# Altium schematic sheet HV9150 DevKit.SchDoc: HV9150 DevKit
size A4; Organization: Altium Limited; Address1: L3, 12a Rodborough Rd; Address2: Frenchs Forest; Address3: NSW; Address4: Australia 2086; DocumentNumber: 1; Revision: 1.0; SheetNumber: 1; SheetTotal: 1
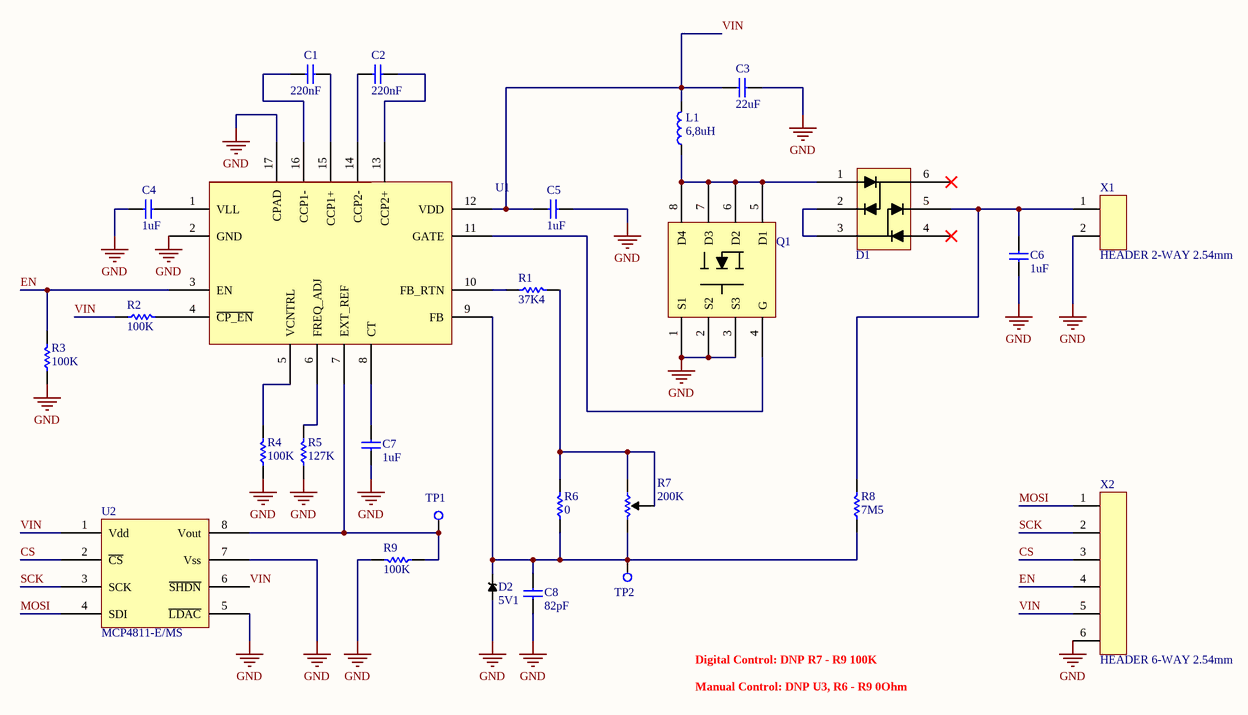
[diagram p0: HV9150 DevKit.SchDoc]

## Parts
C1  220nF  [CAP 0805/2012]
C2  220nF  [CAP 0805/2012]
C3  22uF  [CAP 1206/3216]
C4  1uF  [CAP 0805/2012]
C5  1uF  [CAP 0805/2012]
C6  1uF  [CAP 2220/5650]
C7  1uF  [CAP 0805/2012]
C8  82pF  [CAP 0805/2012]
D1  BAV99S,115  [SOT-363]  (value not drawn)
D2  5V1  [DZ2705100L -  Diodo Zener]
L1  6,8uH  [WE-LHMI_4020]
Q1  BSZ42DN25NS3G  [BSZ42DN25NS3]  (value not drawn)
R1  37K4  [RES 0805/2012]
R2  100K  [RES 0805/2012]
R3  100K  [RES 0805/2012]
R4  100K  [RES 0805/2012]
R5  127K  [RES 0805/2012]
R6  0  [RES 0805/2012]
R7  200K  [BOURNS 3386F]
R8  7M5  [RES 1206/3216]
R9  100K  [RES 0805/2012]
TP1  TESTPOINT  [TP_SMD_Ø1.0mm]  (value not drawn)
TP2  TESTPOINT  [TP_SMD_Ø1.0mm]  (value not drawn)
U1  HV9150K6-G  [QFN16 3X3]  (value not drawn)
U2  MCP4811-E/MS  [MSOP8]
X1  HEADER 2-WAY 2.54mm  [HEADER 2-WAY 2.54 mm]
X2  HEADER 6-WAY 2.54mm  [HEADER 6-WAY 2.54 mm]

## Nets
GND: C3.2 C4.1 C5.1 C6.1 C7.1 C8.1 D2.1(A) Q1.1(S1) Q1.2(S2) Q1.3(S3) R3.1 R4.1 R5.1 R9.2 U1.2(GND) U1.17(CPAD) U2.5(~{LDAC}) U2.7(Vss) X1.2 X2.6
CS: U2.2(~{CS}) X2.3
EN: R3.2 U1.3(EN) X2.4
MOSI: U2.4(SDI) X2.1
SCK: U2.3(SCK) X2.2
VIN: C3.1 C5.2 L1.2 R2.1 U1.12(VDD) U2.1(Vdd) U2.6(~{SHDN}) X2.5
NetC1_1: C1.1 U1.16(CCP1-)
NetC1_2: C1.2 U1.15(CCP1+)
NetC2_1: C2.1 U1.14(CCP2-)
NetC2_2: C2.2 U1.13(CCP2+)
NetC4_2: C4.2 U1.1(VLL)
NetC6_2: C6.2 D1.5 R8.2 X1.1
NetC7_2: C7.2 U1.8(CT)
NetC8_2: C8.2 D2.2(K) R6.1 R7.3 R8.1 TP2.1(TP) U1.9(FB)
NetD1_1: D1.1 L1.1 Q1.5(D1) Q1.6(D2) Q1.7(D3) Q1.8(D4)
NetD1_2: D1.2 D1.3
NetQ1_4: Q1.4(G) U1.11(GATE)
NetR1_1: R1.1 U1.10(FB_RTN)
NetR1_2: R1.2 R6.2 R7.1 R7.2
NetR2_2: R2.2 U1.4(~{CP_EN})
NetR4_2: R4.2 U1.5(VCNTRL)
NetR5_2: R5.2 U1.6(FREQ_ADJ)
NetR9_1: R9.1 TP1.1(TP) U1.7(EXT_REF) U2.8(Vout)

Not connected (* = marked no-connect by the designer): D1 4* 6*

## Notes on the sheet
- Digital Control: DNP R7 - R9 100K
- Manual Control: DNP U3, R6 - R9 0Ohm
- Title:
- Size:
- Date:
- A4
- Number:
- Revision:
- Sheet
- of
- File:

## Library data of the parts
C1 C2 = 0805YC224MAT2A: CAPACITOR 220nF 0805 20%16V; Manufacturer: Kyocera AVX; Tolerance: 20%; Voltage Rating: 16V; Dielectric: X7R; Dissipation Factor: 3.5%; Supplier 1: Farnell; Manufacturer Part Number: 0805YC224MAT2A; Stock 1: 0; Pricing 1: 4000=0.0977, 8000=0.0958, 16000=0.0934 (EUR); Mount: Surface Mount; Case/Package: 0805; Number of Pins: 2; Case Code (Imperial): 0805; Case Code (Metric): 2012; Min Operating Temperature: -55°C; Max Operating Temperature: 125°C; Capacitance: 220nF; Packaging: Tape and Reel; Package Quantity: 4000; Voltage Rating (DC): 16V; Termination: SMD/SMT; Length: 2.01mm; Height: 0.94mm; Width: 1.25mm; Thickness: 0.037inch; Depth: 1.25mm; REACH SVHC: Unknown; Lead Free: Lead Free; ComponentLink1URL: http://www.mouser.com/ds/2/40/X7RDielectric-777024.pdf?src-supplier=Mouser; ComponentLink1Description: http://www.mouser.com/ds/2/40/X7RDielectric-777024.pdf?src-supplier=Mouser; ComponentLink2URL: http://www.avx.com/docs/Catalogs/cx7r.pdf?src-supplier=Avnet; ComponentLink2Description: http://www.avx.com/docs/Catalogs/cx7r.pdf?src-supplier=Avnet; ComponentLink3URL: http://datasheets.avx.com/X7RDielectric.pdf?src-supplier=Digi-Key; ComponentLink3Description: http://datasheets.avx.com/X7RDielectric.pdf?src-supplier=Digi-Key; Value: 220nF
C3 = F931C226MAA: CAPACITOR 22uF 1206 20% 16V; Manufacturer: Kyocera AVX; Supplier 1: Farnell; Manufacturer Part Number: F931C226MAA; Stock 1: 0; Pricing 1: 150=0.395, 250=0.29, 500=0.249, 1000=0.22, 2000=0.188, 10000=0.173 (EUR); Value: 22uF
C4 C5 C7 = CC0805KKX7R7BB105: CAPACITOR 1uF 0805 10% 16V; Manufacturer: Yageo; Dielectric: X7R; Supplier 1: Farnell; Manufacturer Part Number: CC0805KKX7R7BB105; Stock 1: 0; Mount: Surface Mount; Case/Package: 0805; Case Code (Metric): 2012; Case Code (Imperial): 0805; Min Operating Temperature: -55°C; Max Operating Temperature: 125°C; Capacitance: 1uF; Tolerance: 10%; Packaging: Tape and Reel; Voltage Rating: 16V; Package Quantity: 1; Termination: SMD/SMT; Voltage Rating (DC): 16V; Length: 2mm; Depth: 1.25mm; Width: 0.049inch; Thickness: 0.049inch; Radiation Hardening: No; REACH SVHC: No SVHC; Lead Free: Lead Free; Halogen Free: Halogen Free; ComponentLink1URL: http://www.yageo.com/documents/recent/UPY-GPHC_X7R_6.3V-to-50V_18.pdf?src-supplier=Digi-Key; ComponentLink1Description: http://www.yageo.com/documents/recent/UPY-GPHC_X7R_6.3V-to-50V_18.pdf?src-supplier=Digi-Key; ComponentLink2URL: http://www.mouser.com/ds/2/447/Yageo_UPY-GP_NP0_16V-to-50V_9-358835.pdf?src-supplier=Mouser; ComponentLink2Description: http://www.mouser.com/ds/2/447/Yageo_UPY-GP_NP0_16V-to-50V_9-358835.pdf?src-supplier=Mouser; ComponentLink3URL: https://www.verical.com/server-webapp/html/getDatasheet?partID=251802&src-supplier=Verical; ComponentLink3Description: https://www.verical.com/server-webapp/html/getDatasheet?partID=251802&src-supplier=Verical; ComponentLink4URL: http://www.farnell.com/datasheets/1489800.pdf?src-supplier=Element14; ComponentLink4Description: http://www.farnell.com/datasheets/1489800.pdf?src-supplier=Element14; ComponentLink5URL: http://www.yageo.com/documents/recent/UPY-GPHC_X7R_6.3V-to-50V_8.pdf?src-supplier=Avnet; ComponentLink5Description: http://www.yageo.com/documents/recent/UPY-GPHC_X7R_6.3V-to-50V_8.pdf?src-supplier=Avnet; Value: 1uF
C6 = C2220C105MCR2C7186: CAPACITOR 1uF 2220 20% 500V; Manufacturer: KEMET; Dielectric Material: Ceramic; Dielectric: X7R; Voltage Rating (DC): 1kV; Supplier 1: Farnell; Manufacturer Part Number: C2220C105MCR2C7186; Stock 1: 0; Mount: Surface Mount; Case/Package: 2220; Case Code (Imperial): 2220; Case Code (Metric): 5650; Min Operating Temperature: -55°C; Max Operating Temperature: 125°C; Tolerance: 20%; Capacitance: 1uF; Package Quantity: 1; Voltage Rating: 500V; Packaging: Tape and Reel; Termination: SMD/SMT; Length: 6mm; Height: 5mm; Width: 5mm; Thickness: 0.217inch; Depth: 5mm; ComponentLink1URL: https://search.kemet.com/component-edge/download/datasheet/C2220C105MCR2C7186.pdf?src-supplier=Digi-Key; ComponentLink1Description: https://search.kemet.com/component-edge/download/datasheet/C2220C105MCR2C7186.pdf?src-supplier=Digi-Key; ComponentLink2URL: https://api.kemet.com/component-edge/download/datasheet/C2220C105MCR2C7186.pdf?src-supplier=Digi-Key; ComponentLink2Description: https://api.kemet.com/component-edge/download/datasheet/C2220C105MCR2C7186.pdf?src-supplier=Digi-Key; Value: 1uF
C8 = MC0805N820K500CT: CAPACITOR 82pF 0805 5% 50V; Manufacturer: Multicomp; Tolerance: 10%; Dielectric: C0G; Supplier 1: Farnell; Manufacturer Part Number: MC0805N820K500CT; Stock 1: 3804; Pricing 1: 1=0.0563, 10=0.0483, 50=0.0402, 100=0.0313, 250=0.0245, 500=0.0201 (EUR); Case/Package: 0805; Number of Pins: 2; Case Code (Metric): 2012; Case Code (Imperial): 0805; Min Operating Temperature: -55°C; Max Operating Temperature: 125°C; Capacitance: 82pF; Voltage Rating: 50V; Packaging: Cut Tape; Voltage Rating (DC): 50V; REACH SVHC: Unknown; ComponentLink1URL: http://www.newark.com/pdfs/datasheets/spc/Ta-1100.pdf?src-supplier=Element14; ComponentLink1Description: http://www.newark.com/pdfs/datasheets/spc/Ta-1100.pdf?src-supplier=Element14; Value: 82pF
D1 = BAV99S,115: BAV99S Diodes 100 V; Manufacturer: NXP Semiconductors; Forward Current: 200mA; Reverse Recovery Time: 4ns; Max Repetitive Reverse Voltage (Vrrm): 100V; Forward Voltage: 1.25V; Peak Non-Repetitive Surge Current: 4A; Max Reverse Leakage Current: 500nA; Power Dissipation: 250mW; Voltage: 75V; Current: 2A; Supplier 1: Farnell; Manufacturer Part Number: BAV99S,115; Stock 1: 54000; Pricing 1: 3000=0.0431, 9000=0.0336 (EUR); Mount: Surface Mount; Case/Package: TSSOP; Number of Pins: 6; Weight: 0.01lb; Min Operating Temperature: -65°C; Max Operating Temperature: 150°C; Packaging: Tape and Reel; Max Reverse Voltage (DC): 100V; Average Rectified Current: 200mA; Max Surge Current: 4A; Recovery Time: 4ns; Package Quantity: 1; Max Forward Surge Current (Ifsm): 4A; Peak Reverse Current: 500nA; Length: 2.2mm; Height: 1mm; Width: 1.35mm; Radiation Hardening: No; Lead Free: Lead Free; REACH SVHC: No SVHC; ComponentLink1URL: http://www.nxp.com/documents/data_sheet/BAV99_SER.pdf?ecmp=mouser&src-supplier=Mouser; ComponentLink1Description: http://www.nxp.com/documents/data_sheet/BAV99_SER.pdf?ecmp=mouser&src-supplier=Mouser; ComponentLink2URL: http://www.nxp.com/documents/data_sheet/BAV99_SER.pdf?src-supplier=Future+Electronics; ComponentLink2Description: http://www.nxp.com/documents/data_sheet/BAV99_SER.pdf?src-supplier=Future+Electronics; ComponentLink3URL: http://www.farnell.com/datasheets/953882.pdf?src-supplier=Element14; ComponentLink3Description: http://www.farnell.com/datasheets/953882.pdf?src-supplier=Element14; ComponentLink4URL: http://www.nxp.com/documents/data_sheet/BAV99_SER.pdf?src-supplier=Avnet+Europe; ComponentLink4Description: http://www.nxp.com/documents/data_sheet/BAV99_SER.pdf?src-supplier=Avnet+Europe; ComponentLink5URL: http://www.farnell.com/datasheets/953882.pdf?src-supplier=Farnell; ComponentLink5Description: http://www.farnell.com/datasheets/953882.pdf?src-supplier=Farnell; ComponentLink6URL: http://www.nxp.com/documents/data_sheet/BAV99_SER.pdf?src-supplier=Avnet; ComponentLink6Description: http://www.nxp.com/documents/data_sheet/BAV99_SER.pdf?src-supplier=Avnet; ComponentLink7URL: http://www.nxp.com/documents/data_sheet/BAV99_SER.pdf?src-supplier=Digi-Key; ComponentLink7Description: http://www.nxp.com/documents/data_sheet/BAV99_SER.pdf?src-supplier=Digi-Key; ComponentLink8URL: http://www.nxp.com/documents/data_sheet/BAV99_SER.pdf?src-supplier=Avnet+Asia; ComponentLink8Description: http://www.nxp.com/documents/data_sheet/BAV99_SER.pdf?src-supplier=Avnet+Asia
D2 = DZ2705100L: ZENER Diode 5V1; Manufacturer: Panasonic SSG; Max Power Dissipation: 120mW; Tolerance: 5%; Forward Voltage: 1V; Impedance: 60R; Zener Voltage: 5.1V; Max Reverse Leakage Current: 1uA; Test Current: 5mA; Element Configuration: Single; Supplier 1: Farnell; Manufacturer Part Number: DZ2705100L; Stock 1: 0; Pricing 1: 5=0.186, 25=0.182, 100=0.0832, 250=0.0767, 500=0.0588, 1000=0.0357, 5000=0.0284 (EUR); Mount: Surface Mount; Case/Package: SMD/SMT; Number of Pins: 2; Min Operating Temperature: -40°C; Max Operating Temperature: 150°C; Packaging: Tape and Reel; Package Quantity: 10000; Voltage Tolerance: 5%; Length: 1mm; Height: 0.47mm; Width: 0.6mm; REACH SVHC: Unknown; Lead Free: Lead Free; ComponentLink1URL: http://www.farnell.com/datasheets/1912112.pdf?src-supplier=Element14; ComponentLink1Description: http://www.farnell.com/datasheets/1912112.pdf?src-supplier=Element14; Value: 5V1
L1 = 74437324068: INDUCTOR 6,8 uH 20% 1,75 A; Manufacturer: Wurth Electronics; Core Material: Ferrite,Composite; Frequency: 29MHz; Current Rating: 1.75A; Saturation Current: 3.5A; Shielding: Shielded; Inductance: 6.8uH; DC Resistance (DCR): 172mR; Test Frequency: 100kHz; Supplier 1: Farnell; Manufacturer Part Number: 74437324068; Stock 1: 0; Mount: Surface Mount; Case/Package: Nonstandard; Min Operating Temperature: -40°C; Max Operating Temperature: 125°C; Tolerance: 20%; Inductance Tolerance: 20%; Package Quantity: 3000; Packaging: Tape and Reel; Self Resonant Frequency: 29MHz; Composition: Wirewound; Max DC Current: 1.75A; Termination: SMD/SMT; RMS Current (Irms): 1.75A; Series Resistance: 172mR; Length: 4.45mm; Height: 1.8mm; Width: 4.06mm; Height - Seated (Max): 0.079inch; Depth: 4.06mm; REACH SVHC: Unknown; ComponentLink1URL: http://www.farnell.com/datasheets/1735828.pdf?src-supplier=Element14; ComponentLink1Description: http://www.farnell.com/datasheets/1735828.pdf?src-supplier=Element14; ComponentLink2URL: http://katalog.we-online.de/pbs/datasheet/74437324068.pdf?src-supplier=Digi-Key; ComponentLink2Description: http://katalog.we-online.de/pbs/datasheet/74437324068.pdf?src-supplier=Digi-Key; ComponentLink3URL: http://www.mouser.com/ds/2/445/74437324068-538785.pdf?src-supplier=Mouser; ComponentLink3Description: http://www.mouser.com/ds/2/445/74437324068-538785.pdf?src-supplier=Mouser; Value: 6,8uH
Q1 = BSZ42DN25NS3G: BSZ42DN25NS3G 250 V MOSFET; Manufacturer: Infineon; Continuous Drain Current (ID): 5A; Turn-Off Delay Time: 8ns; Turn-On Delay Time: 3ns; Gate to Source Voltage (Vgs): 20V; Rise Time: 2ns; Input Capacitance: 530pF; Max Power Dissipation: 40W; Drain to Source Resistance: 425mR; Element Configuration: Single; Rds On Max: 400mR; Drain to Source Breakdown Voltage: 250V; Fall Time: 5ns; Power Dissipation: 33.8W; Supplier 1: Mouser; Manufacturer Part Number: BSZ42DN25NS3G; Stock 1: 0; Case/Package: TO-220-3; Number of Pins: 8; Min Operating Temperature: -55°C; Max Operating Temperature: 150°C; Package Quantity: 1; Packaging: Tape and Reel; Length: 3.4mm; Height: 1.1mm; Width: 3.4mm; Halogen Free: Halogen Free; ComponentLink1URL: http://www.infineon.com/dgdl/BSZ42DN25NS3+Rev2.2.pdf?folderId=db3a304325305e6d012596c6ca7b290a&fileId=db3a30432ad629a6012b15e5a93b1a8b&src-supplier=Digi-Key; ComponentLink1Description: http://www.infineon.com/dgdl/BSZ42DN25NS3+Rev2.2.pdf?folderId=db3a304325305e6d012596c6ca7b290a&fileId=db3a30432ad629a6012b15e5a93b1a8b&src-supplier=Digi-Key; ComponentLink2URL: http://www.mouser.com/ds/2/196/BSZ42DN25NS3%20Rev2.3-91542.pdf?src-supplier=Mouser; ComponentLink2Description: http://www.mouser.com/ds/2/196/BSZ42DN25NS3%20Rev2.3-91542.pdf?src-supplier=Mouser
R1 = ERJ6ENF3742V: RESISTOR 37K4 0805 1% 1/8mW; Manufacturer: Panasonic; Manufacturer Part Number: ERJ-6ENF3742V; Power Rating: 125mW; Voltage Rating: 150V; Resistance: 37.4kR; Temperature Coefficient: 100ppm/°C; Supplier 1: Farnell; Stock 1: 0; Mount: Surface Mount; Case/Package: 0805; Case Code (Imperial): 0805; Case Code (Metric): 2012; Contact Plating: Tin; Min Operating Temperature: -55°C; Max Operating Temperature: 155°C; Tolerance: 1%; Packaging: Tape and Reel; Package Quantity: 1; Termination: SMD/SMT; Composition: Thick Film; Number of Terminations: 2; Military Standard: Not; Max Power Dissipation: 125mW; Voltage Rating (DC): 150V; Features: Automotive AEC-Q200; Length: 2mm; Height: 0.6mm; Width: 1.2mm; Depth: 1.25mm; Height - Seated (Max): 0.028inch; REACH SVHC: Unknown; Lead Free: Lead Free; ComponentLink1URL: http://www.farnell.com/datasheets/1678782.pdf?src-supplier=Farnell; ComponentLink1Description: http://www.farnell.com/datasheets/1678782.pdf?src-supplier=Farnell; ComponentLink2URL: http://www.industrial.panasonic.com/www-data/pdf/AOA0000/AOA0000CE2.pdf?src-supplier=Element14; ComponentLink2Description: http://www.industrial.panasonic.com/www-data/pdf/AOA0000/AOA0000CE2.pdf?src-supplier=Element14; ComponentLink3URL: http://www.farnell.com/datasheets/1678782.pdf?src-supplier=Element14; ComponentLink3Description: http://www.farnell.com/datasheets/1678782.pdf?src-supplier=Element14; ComponentLink4URL: http://industrial.panasonic.com/www-data/pdf/AOA0000/AOA0000CE2.pdf?src-supplier=Avnet; ComponentLink4Description: http://industrial.panasonic.com/www-data/pdf/AOA0000/AOA0000CE2.pdf?src-supplier=Avnet; Value: 37K4
R2-R4 R9 = ERJ-6ENF1003V: RESISTOR 100K 0805 1% 1/8W; Manufacturer: Panasonic; Resistance: 100kR; Temperature Coefficient: 100ppm/°C; Power Rating: 125mW; Voltage Rating: 150V; Supplier 1: Farnell; Manufacturer Part Number: ERJ-6ENF1003V; Stock 1: 0; Mount: Surface Mount; Case/Package: 0805; Number of Pins: 2; Contact Plating: Tin; Case Code (Metric): 2012; Case Code (Imperial): 0805; Min Operating Temperature: -55°C; Max Operating Temperature: 155°C; Tolerance: 1%; Composition: Thick Film; Packaging: Tape and Reel; Package Quantity: 1; Number of Terminations: 2; Military Standard: Not; Termination: SMD/SMT; Max Power Dissipation: 125mW; Voltage Rating (DC): 150V; Features: Automotive AEC-Q200; Length: 2mm; Height: 0.6mm; Width: 0.049inch; Depth: 1.25mm; Radiation Hardening: No; REACH SVHC: No SVHC; Lead Free: Lead Free; ComponentLink1URL: http://www.farnell.com/datasheets/426256.pdf?src-supplier=Element14; ComponentLink1Description: http://www.farnell.com/datasheets/426256.pdf?src-supplier=Element14; ComponentLink2URL: http://www.farnell.com/datasheets/1678782.pdf?src-supplier=Element14; ComponentLink2Description: http://www.farnell.com/datasheets/1678782.pdf?src-supplier=Element14; ComponentLink3URL: http://www.jameco.com/Jameco/Products/ProdDS/1988989.pdf?src-supplier=Jameco; ComponentLink3Description: http://www.jameco.com/Jameco/Products/ProdDS/1988989.pdf?src-supplier=Jameco; ComponentLink4URL: http://industrial.panasonic.com/www-data/pdf/AOA0000/AOA0000CE2.pdf?src-supplier=Future+Electronics; ComponentLink4Description: http://industrial.panasonic.com/www-data/pdf/AOA0000/AOA0000CE2.pdf?src-supplier=Future+Electronics; ComponentLink5URL: http://industrial.panasonic.com/www-data/pdf/AOA0000/AOA0000CE2.pdf?src-supplier=Avnet+Europe; ComponentLink5Description: http://industrial.panasonic.com/www-data/pdf/AOA0000/AOA0000CE2.pdf?src-supplier=Avnet+Europe; ComponentLink6URL: http://www.mouser.com/ds/2/315/AOA0000C283-1093288.pdf?src-supplier=Mouser; ComponentLink6Description: http://www.mouser.com/ds/2/315/AOA0000C283-1093288.pdf?src-supplier=Mouser; ComponentLink7URL: https://www.alliedelec.com/m/d/623f45ff1957d936ff56d46fd1c28cac.pdf?src-supplier=Allied+Electronics; ComponentLink7Description: https://www.alliedelec.com/m/d/623f45ff1957d936ff56d46fd1c28cac.pdf?src-supplier=Allied+Electronics; ComponentLink8URL: http://industrial.panasonic.com/www-data/pdf/AOA0000/AOA0000CE2.pdf?src-supplier=Avnet; ComponentLink8Description: http://industrial.panasonic.com/www-data/pdf/AOA0000/AOA0000CE2.pdf?src-supplier=Avnet; Value: 100K
R5 = ERJ6ENF1273V: RESISTOR 127K 0805 1% 1/8mW; Manufacturer: Panasonic; Resistance: 127kR; Power Rating: 125mW; Voltage Rating: 150V; Temperature Coefficient: 100ppm/°C; Supplier 1: Farnell; Manufacturer Part Number: ERJ6ENF1273V; Stock 1: 0; Mount: Surface Mount; Case/Package: 0805; Case Code (Metric): 2012; Case Code (Imperial): 0805; Contact Plating: Tin; Min Operating Temperature: -55°C; Max Operating Temperature: 155°C; Tolerance: 1%; Packaging: Tape and Reel; Package Quantity: 1; Composition: Thick Film; Number of Terminations: 2; Military Standard: Not; Max Power Dissipation: 125mW; Voltage Rating (DC): 150V; Features: Automotive AEC-Q200; Length: 2mm; Height: 0.028inch; Width: 0.049inch; Depth: 1.25mm; REACH SVHC: Yes; Lead Free: Lead Free; ComponentLink1URL: http://www.farnell.com/datasheets/1678782.pdf?src-supplier=Element14; ComponentLink1Description: http://www.farnell.com/datasheets/1678782.pdf?src-supplier=Element14; ComponentLink2URL: http://industrial.panasonic.com/www-data/pdf/AOA0000/AOA0000CE2.pdf?src-supplier=Avnet; ComponentLink2Description: http://industrial.panasonic.com/www-data/pdf/AOA0000/AOA0000CE2.pdf?src-supplier=Avnet; ComponentLink3URL: http://www.mouser.com/ds/2/315/AOA0000C283-1093288.pdf?src-supplier=Mouser; ComponentLink3Description: http://www.mouser.com/ds/2/315/AOA0000C283-1093288.pdf?src-supplier=Mouser; Value: 127K
R6 = CRCW08050000Z0ECC: RESISTOR 0K 0805 1% 1/8mW; Manufacturer: Vishay Dale; Supplier 1: Mouser; Manufacturer Part Number: CRCW08050000Z0ECC; Stock 1: 39810; Pricing 1: 1=0.1, 10=0.029, 50=0.029, 100=0.011, 1000=0.004, 10000=0.004 (USD); Value: 0
R7 = 3386F-1-204TLF: POT 200K 3386F 10% 500mW trimmer potentiometer; Manufacturer: Bourns; Resistance: 200kR; Voltage Rating: 300V; Temperature Coefficient: 100ppm/°C; Number of Turns: 1; Supplier 1: Mouser; Manufacturer Part Number: 3386F-1-204TLF; Stock 1: 198; Pricing 1: 1=2.48, 10=1.95, 50=1.88, 100=1.73, 1000=1.35, 10000=1.08 (USD); Mount: Through Hole; Weight: 0.03oz; Min Operating Temperature: -55°C; Max Operating Temperature: 125°C; Tolerance: 10%; Power Rating: 500mW; Packaging: Rail/Tube; Package Quantity: 100; Composition: Cermet; Termination: Pin; Max Power Dissipation: 500mW; Military Standard: Not; Length: 9.53mm; Height: 0.19inch; Depth: 9.53mm; Radiation Hardening: No; REACH SVHC: No SVHC; ComponentLink1URL: http://uk.rs-online.com/webdocs/069c/0900766b8069ccf9.pdf?src-supplier=RSComponents; ComponentLink1Description: http://uk.rs-online.com/webdocs/069c/0900766b8069ccf9.pdf?src-supplier=RSComponents; ComponentLink2URL: http://www.farnell.com/datasheets/1815119.pdf?src-supplier=Element14; ComponentLink2Description: http://www.farnell.com/datasheets/1815119.pdf?src-supplier=Element14; ComponentLink3URL: http://www.bourns.com/data/global/pdfs/3386.pdf?src-supplier=Avnet; ComponentLink3Description: http://www.bourns.com/data/global/pdfs/3386.pdf?src-supplier=Avnet; ComponentLink4URL: http://www.bourns.com/docs/Product-Datasheets/3386.pdf?src-supplier=Digi-Key; ComponentLink4Description: http://www.bourns.com/docs/Product-Datasheets/3386.pdf?src-supplier=Digi-Key; Value: 200K
R8 = MCHVR06FTFV7504: RESISTOR 7M5, 1206, 1%, 0.25W,  500V; Manufacturer: Multicomp; Supplier 1: Farnell; Manufacturer Part Number: MCHVR06FTFV7504; Stock 1: 4730; Pricing 1: 10=0.16, 100=0.107, 500=0.0719, 1000=0.0618, 2500=0.0542, 5000=0.0443, 25000=0.0403, 50000=0.0345 (EUR); Value: 7M5
U1 = HV9150K6-G: Manufacturer: Microchip Supertex; Supplier 1: Mouser; Manufacturer Part Number: HV9150K6-G; Stock 1: 284; Pricing 1: 1=1.49, 10=1.47, 50=1.24, 100=1.13, 1000=1.13, 10000=1.13 (USD); Case/Package: QFN; Number of Pins: 16; Packaging: Tape and Reel
U2 = MCP4811-E/MS: Manufacturer: Microchip; Resolution: 10b; Integral Nonlinearity (INL): 3.5LSB; Output Type: Voltage; Operating Supply Voltage: 5V; Number of Channels: 1; Interface: SPI,Serial; Min Supply Voltage: 2.7V; Max Supply Voltage: 5.5V; Nominal Supply Current: 330uA; Settling Time: 4.5us; Number of Bits: 10; Polarity: Bipolar; Reference Voltage: 2.048V; Input Offset Voltage (Vos): 820uV; Supplier 1: Mouser; Manufacturer Part Number: MCP4811-E/MS; Stock 1: 905; Pricing 1: 1=1.66, 10=1.64, 50=1.39, 100=1.25, 1000=1.25, 10000=1.25 (USD); Mount: Surface Mount; Case/Package: MSOP; Number of Pins: 8; Min Operating Temperature: -40°C; Max Operating Temperature: 125°C; Packaging: Rail/Tube; Number of DAC Channels: 1; Package Quantity: 100; Number of Converters: 1; Length: 3mm; Height: 0.95mm; Width: 3mm; Radiation Hardening: No; REACH SVHC: No SVHC; Lead Free: Lead Free; ComponentLink1URL: https://www.verical.com/server-webapp/html/getDatasheet?partID=723094&src-supplier=Verical; ComponentLink1Description: https://www.verical.com/server-webapp/html/getDatasheet?partID=723094&src-supplier=Verical; ComponentLink2URL: http://ww1.microchip.com/downloads/en/DeviceDoc/22244B.pdf?src-supplier=Avnet; ComponentLink2Description: http://ww1.microchip.com/downloads/en/DeviceDoc/22244B.pdf?src-supplier=Avnet; ComponentLink3URL: http://www.microchip.com/mymicrochip/filehandler.aspx?ddocname=en547908&src-supplier=Digi-Key; ComponentLink3Description: http://www.microchip.com/mymicrochip/filehandler.aspx?ddocname=en547908&src-supplier=Digi-Key; ComponentLink4URL: http://ww1.microchip.com/downloads/en/DeviceDoc/22244B.pdf?src-supplier=Avnet+Europe; ComponentLink4Description: http://ww1.microchip.com/downloads/en/DeviceDoc/22244B.pdf?src-supplier=Avnet+Europe; ComponentLink5URL: http://www.farnell.com/datasheets/630375.pdf?src-supplier=Element14; ComponentLink5Description: http://www.farnell.com/datasheets/630375.pdf?src-supplier=Element14; ComponentLink6URL: https://www.distrelec.biz/Web/Downloads/he/et/MCP4801_11_eng_datasheet.pdf?mime=application%2Fpdf&src-supplier=Distrelec; ComponentLink6Description: https://www.distrelec.biz/Web/Downloads/he/et/MCP4801_11_eng_datasheet.pdf?mime=application%2Fpdf&src-supplier=Distrelec; ComponentLink7URL: http://www.mouser.com/ds/2/268/22244B-54643.pdf?src-supplier=Mouser; ComponentLink7Description: http://www.mouser.com/ds/2/268/22244B-54643.pdf?src-supplier=Mouser; ComponentLink8URL: http://www.produktinfo.conrad.com/datenblaetter/1000000-1099999/001083269-da-01-en-DAC_10B_SPI_VREF_MCP4811_E_MS_MSOP_8_MCP.pdf?src-supplier=Conrad; ComponentLink8Description: http://www.produktinfo.conrad.com/datenblaetter/1000000-1099999/001083269-da-01-en-DAC_10B_SPI_VREF_MCP4811_E_MS_MSOP_8_MCP.pdf?src-supplier=Conrad
X1 = HEADER 2-WAY 2.54mm: HEADER 2-WAY
X2 = HEADER 6-WAY 2.54mm: HEADER 6-WAY